# Altium schematic sheet DCI_TCAN_ADC.SchDoc
size A
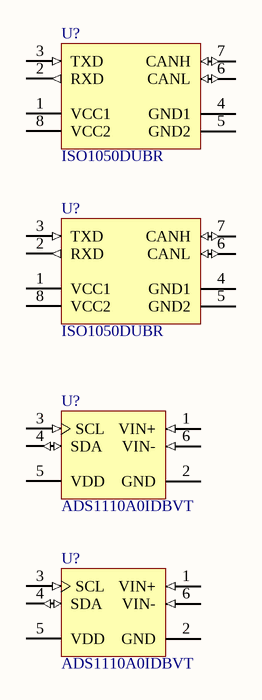
[diagram p0: DCI_TCAN_ADC.SchDoc]

## Parts
(Parts that share a designator on the sheet are numbered #1, #2 ... from top to bottom, then left to right.)
U?#1  ISO1050DUBR  [DUB0008A_L]
U?#2  ISO1050DUBR  [DUB0008A_L]
U?#3  ADS1110A0IDBVT  [TI-DBV6_N]
U?#4  ADS1110A0IDBVT  [TI-DBV6_N]

## Nets

Not connected (* = marked no-connect by the designer): U?#1 1(VCC1) 2(RXD) 3(TXD) 4(GND1) 5(GND2) 6(CANL) 7(CANH) 8(VCC2); U?#2 1(VCC1) 2(RXD) 3(TXD) 4(GND1) 5(GND2) 6(CANL) 7(CANH) 8(VCC2); U?#3 1(VIN+) 2(GND) 3(SCL) 4(SDA) 5(VDD) 6(VIN-); U?#4 1(VIN+) 2(GND) 3(SCL) 4(SDA) 5(VDD) 6(VIN-)

## Library data of the parts
U?#1 U?#2 = CMP-0315-00093-2: Isolated CAN Transceiver, -55 to 105 degC, 8-pin SOP (DUB), Green (RoHS & no Sb/Br); Manufacturer: Texas Instruments; Rating: Catalog; Isolated: Yes; Drivers Per Package: 1; PackageReference: DUB0008A; PartNumber: ISO1050DUBR; ComponentLink2Description: Package Specification; ComponentLink1Description: Datasheet; Mounting Technology: Surface Mount; ComponentLink1URL: http://www.ti.com/general/docs/lit/getliterature.tsp?genericPartNumber=ISO1050&fileType=pdf; ComponentLink2URL: http://www.ti.com/litv/pdf/mpds247b; Eco-Plan: Green (RoHS & no Sb/Br); PackageDescription: 8-Pin Small Outline Package 2.54 mm Pitch; PackageVersion: revC, May-2006; SubFamily: CAN; DatasheetVersion: SLLS983E
U?#3 U?#4 = CMP-0003-00281-2: 16-Bit Delta-Sigma ADC with Internal Reference, PGA and Oscillator, I2C Serial Interface, -40 to 85 degC, 6-pin SOT23 (DBV6), Green (RoHS & no Sb/Br); Manufacturer: Texas Instruments; SubFamily: Precision ADC (<=10MSPS); Sample Rate (max)(SPS): 240; Digital Supply(Max)(V): 5.5; Interface: Serial I2C; Digital Supply(Min)(V): 2.7; Resolution(Bits): 16; # Input Channels: 1; PackageDescription: 6-Pin Plastic Small Outline, Body 1.6 x 2.9 mm, Pitch 0.95 mm; ComponentLink2Description: Datasheet; ComponentLink3URL: http://www.ti.com/litv/pdf/mpds026h; PackageReference: DBV6; ComponentLink1Description: Manufacturer URL; Analog Voltage AV/DD(Max)(V): 5.5; Mounting Technology: Surface Mount; ComponentLink3Description: Package Specification; PartNumber: ADS1110A0IDBVT; Architecture: Delta-Sigma; ComponentLink1URL: http://www.ti.com/; Code_JEDEC: MO-178; ComponentLink2URL: http://www.ti.com/general/docs/lit/getliterature.tsp?genericPartNumber=ADS1110&fileType=pdf; DatasheetVersion: SBAS276A; Analog Voltage AV/DD(Min)(V): 2.7; PackageVersion: 4073253-5/K, 03/2006; Eco-Plan: Green (RoHS & no Sb/Br)